# EAGLE design LB_BIT_i21_MICROPHONE-v03(rev4_4) (EAGLE 6.6.0)
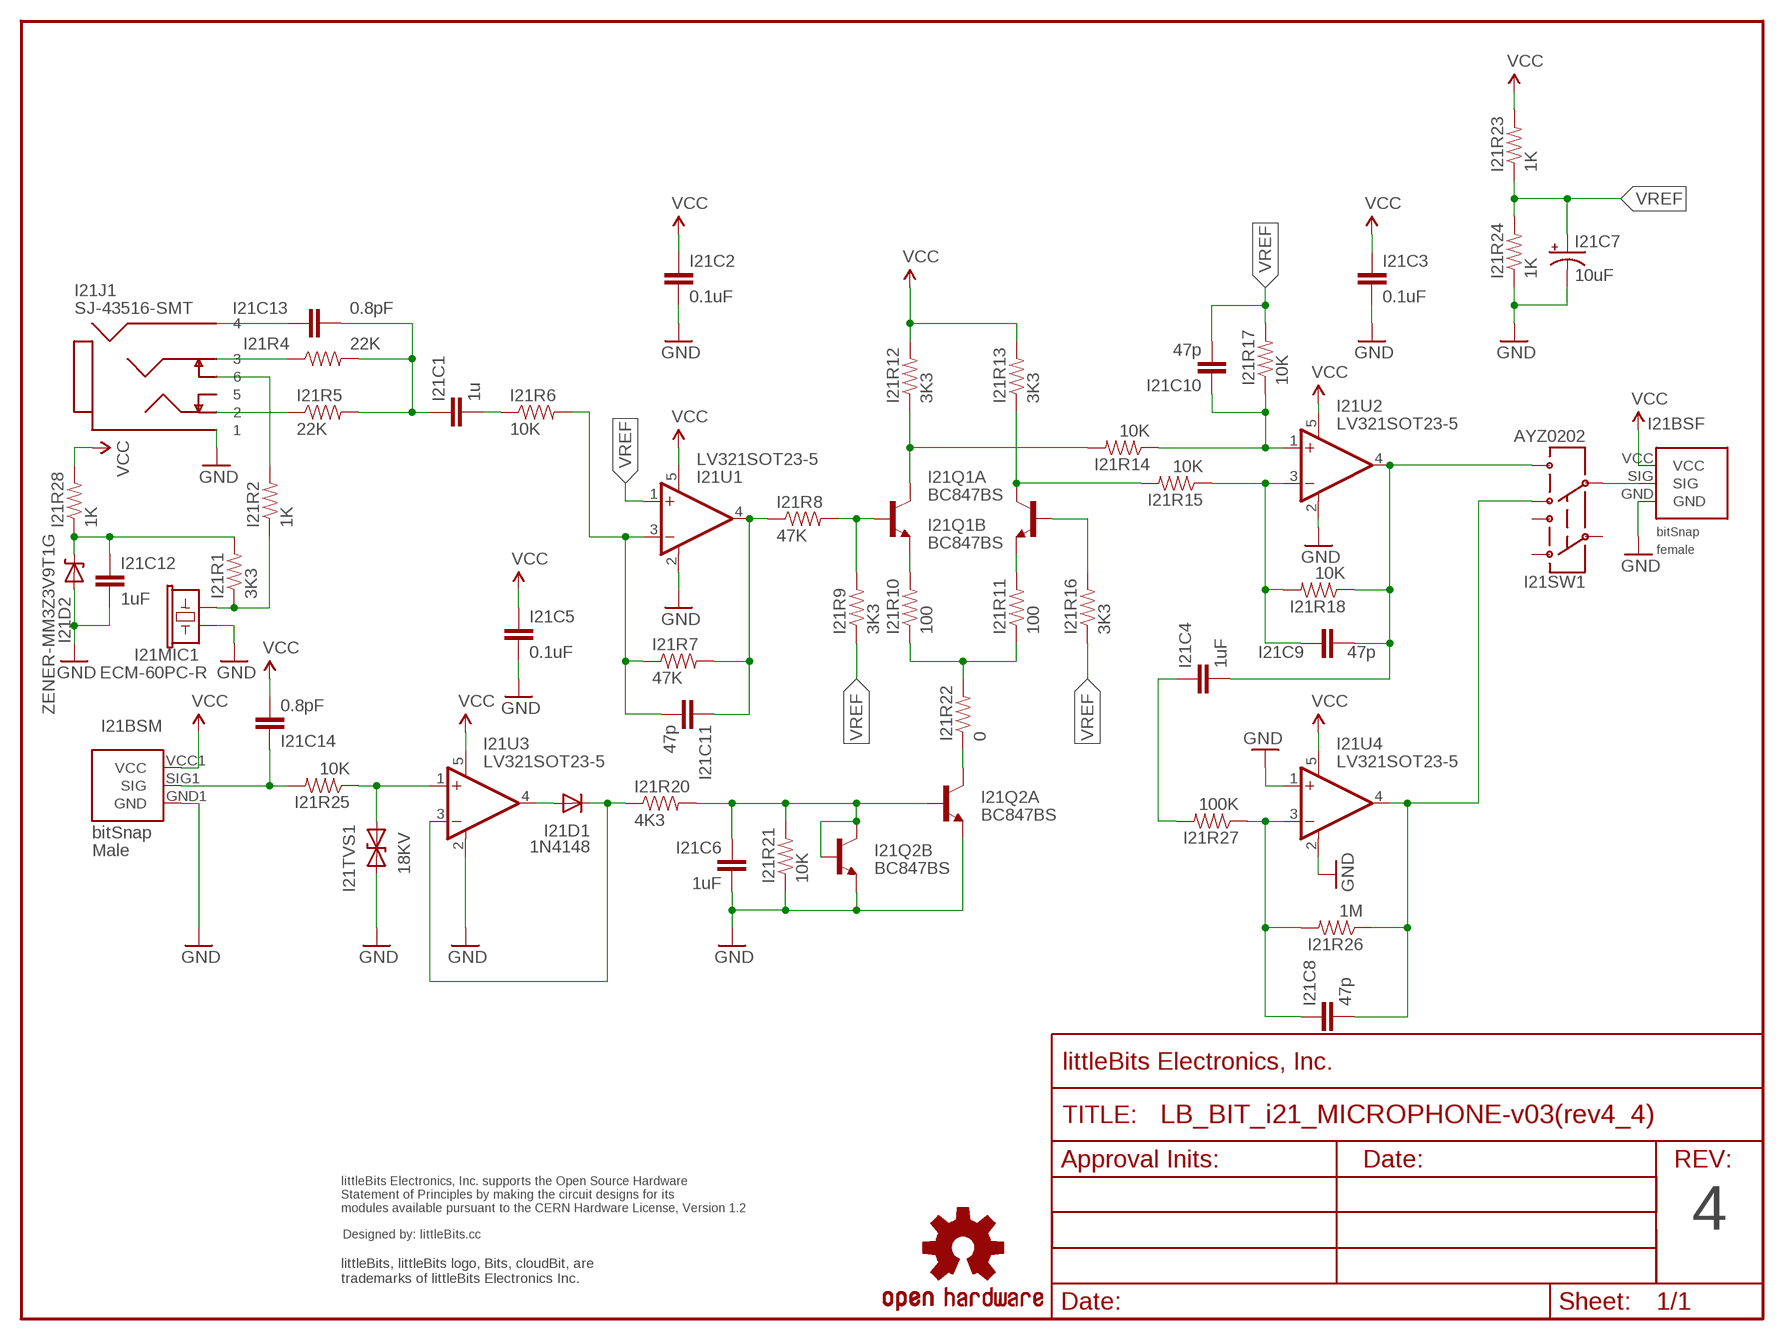
[diagram p0: schematic, sheet 1]

## Parts
I21BSF  BITSNAP_V03_FEMALE  [BITSNAP_V03_FEMALE]
I21BSM  BITSNAP_V03_MALE  [BITSNAP_V03_MALE]
I21C1  1u  CAPCAP-0603  [CAP-0603]
I21C2  0.1uF  CAPCAP-0603  [CAP-0603]
I21C3  0.1uF  CAPCAP-0603  [CAP-0603]
I21C4  1uF  CAPCAP-0603  [CAP-0603]
I21C5  0.1uF  CAPCAP-0603  [CAP-0603]
I21C6  1uF  CAPCAP-0603  [CAP-0603]
I21C7  10uF  CAP_POL3216  [EIA3216]
I21C8  47p  CAPCAP-0603  [CAP-0603]
I21C9  47p  CAPCAP-0603  [CAP-0603]
I21C10  47p  CAPCAP-0603  [CAP-0603]
I21C11  47p  CAPCAP-0603  [CAP-0603]
I21C12  1uF  CAPCAP-0603  [CAP-0603]
I21C13  0.8pF  CAPCAP-0603  [CAP-0603]
I21C14  0.8pF  CAPCAP-0603  [CAP-0603]
I21D1  1N4148  DIODESOD  [SOD-323]
I21D2  ZENER-MM3Z3V9T1G  DIODE-ZENER-BZT52  [SOD-323]
I21J1  SJ-43516-SMT  JACK-PHONO-4COND-SW  [CUI-SJ-4351]
I21MIC1  ECM-60PC-R  MIC9.7MM  [MIC9.7MM]
I21Q1  BC847BS  TRANS-BJT_NPN-DUAL-BC847BS  [SOT-363_PHILLIPS]
I21Q2  BC847BS  TRANS-BJT_NPN-DUAL-BC847BS  [SOT-363_PHILLIPS]
I21R1  3K3  RESISTOR0603  [RES-0603]
I21R2  1K  RESISTOR0603  [RES-0603]
I21R4  22K  RESISTOR0603  [RES-0603]
I21R5  22K  RESISTOR0603  [RES-0603]
I21R6  10K  RESISTOR0603  [RES-0603]
I21R7  47K  RESISTOR0603  [RES-0603]
I21R8  47K  RESISTOR0603  [RES-0603]
I21R9  3K3  RESISTOR0603  [RES-0603]
I21R10  100  RESISTOR0603  [RES-0603]
I21R11  100  RESISTOR0603  [RES-0603]
I21R12  3K3  RESISTOR0603  [RES-0603]
I21R13  3K3  RESISTOR0603  [RES-0603]
I21R14  10K  RESISTOR0603  [RES-0603]
I21R15  10K  RESISTOR0603  [RES-0603]
I21R16  3K3  RESISTOR0603  [RES-0603]
I21R17  10K  RESISTOR0603  [RES-0603]
I21R18  10K  RESISTOR0603  [RES-0603]
I21R20  4K3  RESISTOR0603  [RES-0603]
I21R21  10K  RESISTOR0603  [RES-0603]
I21R22  0  RESISTOR0603  [RES-0603]
I21R23  1K  RESISTOR0603  [RES-0603]
I21R24  1K  RESISTOR0603  [RES-0603]
I21R25  10K  RESISTOR0603  [RES-0603]
I21R26  1M  RESISTOR0603  [RES-0603]
I21R27  100K  RESISTOR0603  [RES-0603]
I21R28  1K  RESISTOR0603  [RES-0603]
I21SW1  AYZ0202  [AYZ0202]
I21TVS1  18KV  DIODE-TVSSOD-923  [SOD-923]
I21U1  LV321SOT23-5  [SOT23-5]
I21U2  LV321SOT23-5  [SOT23-5]
I21U3  LV321SOT23-5  [SOT23-5]
I21U4  LV321SOT23-5  [SOT23-5]
U$3  OSHWCREDIT  [OSHWCREDIT]
U$4  FRAME-LETTER-OHWOHW  [FABDWG01-OHW]
U$19  OSHW-LOGOL  [OSHW-LOGO-L]

## Nets
GND: I21BSF.GND I21BSM.GND1(GND) I21C2.2 I21C3.2 I21C5.2 I21C6.2 I21C7.- I21C12.2 I21D2.2(A) I21J1.1 I21MIC1.2 I21Q2.1(A:E) I21Q2.4(B:E) I21R21.1 I21R24.1 I21TVS1.1(A) I21U1.2(V-) I21U2.2(V-) I21U3.2(V-) I21U4.1(+IN) I21U4.2(V-)
N$1: I21BSM.SIG1(SIG) I21C14.1 I21R25.2
N$2: I21D1.2(A) I21U3.4(OUT)
N$3: I21D1.1(C) I21R20.1 I21U3.3(-IN)
N$4: I21R25.1 I21TVS1.2(C) I21U3.1(+IN)
N$5: I21C6.1 I21Q2.2(A:B) I21Q2.3(B:C) I21Q2.5(B:B) I21R20.2 I21R21.2
N$6: I21C13.1 I21J1.4
N$7: I21C1.1 I21C13.2 I21R4.2 I21R5.2
N$8: I21C1.2 I21R6.1
N$9: I21J1.6 I21R2.2
N$10: I21MIC1.1 I21R1.1 I21R2.1
N$11: I21C11.2 I21R6.2 I21R7.1 I21U1.3(-IN)
N$12: I21C11.1 I21R7.2 I21R8.1 I21U1.4(OUT)
N$13: I21Q1.2(A:B) I21R8.2 I21R9.2
N$14: I21Q1.1(A:E) I21R10.2
N$15: I21Q1.4(B:E) I21R11.2
N$16: I21R10.1 I21R11.1 I21R22.2
N$17: I21J1.2 I21R5.1
N$18: I21Q1.3(B:C) I21R13.1 I21R15.2
N$19: I21Q1.5(B:B) I21R16.2
N$20: I21Q1.6(A:C) I21R12.1 I21R14.2
N$21: I21C10.1 I21R14.1 I21R17.1 I21U2.1(+IN)
N$22: I21C9.1 I21R15.1 I21R18.2 I21U2.3(-IN)
N$23: I21C4.2 I21C9.2 I21R18.1 I21SW1.6 I21U2.4(OUT)
N$24: I21Q2.6(A:C) I21R22.1
N$25: I21BSF.SIG I21SW1.5
N$26: I21J1.3 I21R4.1
N$27: I21C8.1 I21R26.2 I21R27.1 I21U4.3(-IN)
N$28: I21C8.2 I21R26.1 I21SW1.4 I21U4.4(OUT)
N$29: I21C4.1 I21R27.2
N$30: I21C12.1 I21D2.1(C) I21R1.2 I21R28.1
VCC: I21BSF.VCC I21BSM.VCC1(VCC) I21C2.1 I21C3.1 I21C5.1 I21C14.2 I21R12.2 I21R13.2 I21R23.2 I21R28.2 I21U1.5(V+) I21U2.5(V+) I21U3.5(V+) I21U4.5(V+)
VREF: I21C7.+ I21C10.2 I21R9.1 I21R16.1 I21R17.2 I21R23.1 I21R24.2 I21U1.1(+IN)
Unconnected: I21J1.5 I21SW1.1 I21SW1.2 I21SW1.3

## Notes on the sheet
- 4

## Library data of the parts
I21BSF = bitSnap:BITSNAP_V03_FEMALE
I21BSM = bitSnap:BITSNAP_V03_MALE
I21C1-I21C6 I21C8-I21C14 = LITTLEBITS:CAP
I21C7 = LITTLEBITS:CAP_POL
I21D1 = LITTLEBITS:DIODE: Diode These are standard reverse protection diodes and small signal diodes. SMA package can handle up to about 1A. SOD-323 can handle about 200mA. What the SOD-323 package when ordering, there are some mfgs out there that are 5-pin packages.
I21D2 = LITTLEBITS:DIODE-ZENER: Zener Diode Production Part - 8199 3.4V Zener Voltage
I21J1 = LITTLEBITS:JACK-PHONO-4COND-SW
I21MIC1 = LITTLEBITS:MIC9.7MM
I21Q1 I21Q2 = LITTLEBITS:TRANS-BJT_NPN-DUAL
I21R1 I21R2 I21R4-I21R18 I21R20-I21R28 = LITTLEBITS:RESISTOR
I21SW1 = LITTLEBITS:AYZ0202
I21TVS1 = LITTLEBITS:DIODE-TVS: Bidirectional Transient Voltage Suppression Diode: Device conducts in avalanche mode after reaching a part dependent voltage threshold. Used for limiting voltage spikes on ESD sensitive inputs and outputs.; IEC_ESD_PROT0: +/-18kV; LB_PN: ?; MPN: ESD9B5.0ST5G; V_CLAMP: ?; V_OPERATION: 5V
I21U1-I21U4 = LITTLEBITS:LV321
U$3 = LITTLEBITS:OSHWCREDIT
U$4 = LITTLEBITS:FRAME-LETTER-OHW
U$19 = SparkFun_NEW:OSHW-LOGO: Open Source Hardware Logo This logo indicates the piece of hardware it is found on incorporates a OSHW license and/or adheres to the definition of open source hardware found here: http://freedomdefined.org/OSHW

## Board
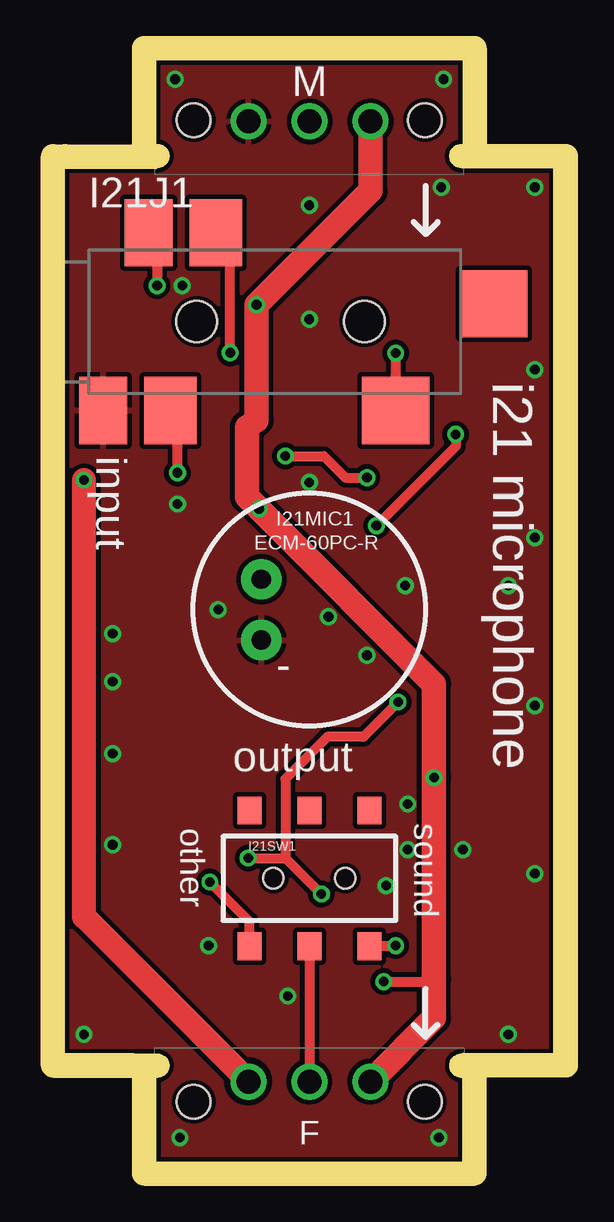
[diagram p1: board, top side]
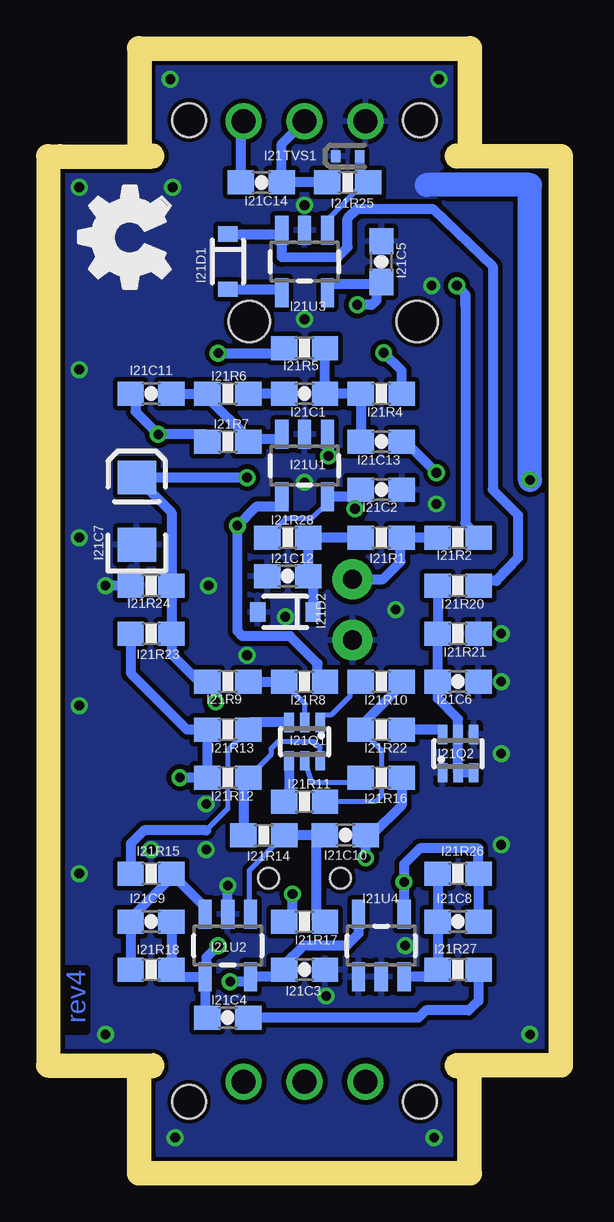
[diagram p2: board, bottom side, seen from below]

Size 20.4 x 45.9 mm. Coordinates in mm from the lower left corner, seen from the top.
Outline: 2.9,4.5 0,4.5 0,41.4
Outline: 20.4,4.5 20.4,41.4
Copper layers (1*16): Top 0.035mm / dielectric 1.5mm / Bottom 0.035mm
Design rules "littleBitsDRC": minimum track width 0.2mm, minimum drill 0.4mm, track to track 0.2mm, track to pad 0.2mm, pad to pad 0.2mm, via to via 0.2mm, smd to smd 0mil, copper to edge 0.2mm, drill to drill 0.2mm, minimum pad ring 0.2mm, minimum via ring 0.15mm, stop-mask expansion 0.1mm, vias tented up to drill 0mil, thermal gap 0.2mm
tRestrict: area 6.9,2.5 to 8.5,4.2; 2 lines
bRestrict: area 6.9,2.6 to 8.4,4.1; 2 lines
Milling: 6 lines

### Footprints (pad centres in the part's own frame; a part is rotated, then mirrored left to right if it is on the bottom)
BITSNAP_V03_FEMALE = drill 1: GND 3.91,3.33; SIG 6.45,3.33; VCC 8.99,3.33 | hole 1.4: 1.63,2.5; 11.27,2.5
BITSNAP_V03_MALE = drill 1: GND1 8.98,2.56; SIG1 6.44,2.56; VCC1 3.9,2.56 | hole 1.4: 11.27,2.5; 1.63,2.5
CAP-0603 = smd 1.1 x 1: 1 -0.85,0; 2 0.85,0
EIA3216 = smd 1.4 x 1.6: + 1.4,0; - -1.4,0
SOD-323 = smd 0.63 x 0.83: 1 -1.15,0; 2 1.15,0
CUI-SJ-4351 = smd 2 x 2.8: 1 0.6,-3.7; 6 2.5,3.7 | smd 2.8 x 2.8: 2 12.8,-3.7; 5 16.9,0.75 | smd 2.2 x 2.8: 3 5.3,3.7; 4 3.4,-3.7 | hole 1.7: 4.5,0; 11.5,0
MIC9.7MM = drill 0.8 pad 1.676: 1 -2,1.27; 2 -2,-1.27
SOT-363_PHILLIPS = smd 0.4 x 0.8: 1 -0.65,-0.8; 2 0,-0.8; 3 0.65,-0.8; 4 0.65,0.8; 5 0,0.8; 6 -0.65,0.8
RES-0603 = smd 1.1 x 1: 1 -0.85,0; 2 0.85,0
AYZ0202 = smd 1 x 1.15: 1 -2.5,2.825; 2 0,2.825; 3 2.5,2.825; 4 -2.5,-2.825; 5 0,-2.825; 6 2.5,-2.825 | hole 0.85: 1.5,0; -1.5,0
SOD-923 = smd 0.4 x 0.5: 1 -0.5,0; 2 0.5,0
SOT23-5 = smd 0.55 x 1.2: 1 -0.95,-1.3; 2 0,-1.3; 3 0.95,-1.3; 4 0.95,1.3; 5 -0.95,1.3

### Placement (x,y rotation side)
I21BSF  3.75,0 0 top
I21BSM  16.65,45.9 180 top
I21C1  10.2,32 180 bottom
I21C2  7,28 0 bottom
I21C3  10.2,8 0 bottom
I21C4  13.4,6 180 bottom
I21C5  7,37.5 90 bottom
I21C6  3.8,20 0 bottom
I21C7  17.2,27.1 90 bottom
I21C8  3.8,10 0 bottom
I21C9  16.6,10 0 bottom
I21C10  8.5,13.6 0 bottom
I21C11  16.6,32 0 bottom
I21C12  10.9,24.4 180 bottom
I21C13  7,30 180 bottom
I21C14  12,40.8 180 bottom
I21D1  13.4,37.5 270 bottom
I21D2  11,22.9 180 bottom
I21J1  1,35 0 top
I21MIC1  10.2,23 0 top
I21Q1  10.2,17.5 180 bottom
I21Q2  3.8,17 0 bottom
I21R1  7,26 180 bottom
I21R2  3.8,26 0 bottom
I21R4  7,32 180 bottom
I21R5  10.2,33.9 0 bottom
I21R6  13.4,32 180 bottom
I21R7  13.4,30 180 bottom
I21R8  10.2,20 180 bottom
I21R9  13.4,20 0 bottom
I21R10  7,20 180 bottom
I21R11  10.2,15 180 bottom
I21R12  13.4,16 180 bottom
I21R13  13.4,18 180 bottom
I21R14  11.9,13.6 180 bottom
I21R15  16.6,12 180 bottom
I21R16  7,16 180 bottom
I21R17  10.2,10 180 bottom
I21R18  16.6,8 180 bottom
I21R20  3.8,24 180 bottom
I21R21  3.8,22 180 bottom
I21R22  7,18 180 bottom
I21R23  16.6,22 180 bottom
I21R24  16.6,24 0 bottom
I21R25  8.4,40.8 180 bottom
I21R26  3.8,12 180 bottom
I21R27  3.8,8 0 bottom
I21R28  10.9,26 180 bottom
I21SW1  10.2,11.8 0 top
I21TVS1  8.4,41.9 0 bottom
I21U1  10.2,29 180 bottom
I21U2  13.4,9 180 bottom
I21U3  10.2,37.5 180 bottom
I21U4  7,9 0 bottom
U$3  -92.75,-63.6 0 top  (outside the outline)
U$4  0,0 0 top
U$8  [OSHW_FILLX150_NOTEXT]  15.81,35.56 0 top
U$19  -24.5,-71.59 0 top  (outside the outline)

### Tracks (layer width: path | path; a pad name or v marks a point on that pad's centre or on a via)
GND  (via drill 0.41)
  Top 1: I21BSF.GND 0.8,10.2 v0.8,28.4
  Bottom 0.2: I21U2.2
  Bottom 0.406: I21U2.2 v13.4,11.5 | I21R24.1 v18.5,24
  Bottom 1: v0.8,28.4 0.8,40.7 5.1,40.7
  other vias: 2,22 2,20 2,17 4.7,27.4 14.2,24 6.4,23 11,22.7 4.9,36.5 10.2,28.3 19.6,40.6 19.6,33 19.6,26 19.6,19 19.6,12 18.5,5.3 4.8,1 15.6,1 15.8,45.1 4.6,45.1 14.3,14.9 10.2,35.1 6,9 10.2,39.85 12.6,21.1 2,13.2 0.8,5.3 16.6,13 14.3,13 9.3,6.9 15.7,40.6
  pour Top: 0,0 0,45.9 20.4,45.9 20.4,0.05
  pour Bottom: 0,0 0,45.9 20.4,45.9 20.4,0.05
N$1
  Bottom 0.406: I21R25.2 I21C14.1 11.15,42.4 I21BSM.SIG1
N$2
  Bottom 0.406: I21D1.2 11.1,36.35 I21U3.4
N$3
  Bottom 0.406: I21D1.1 11.1,38.65 I21U3.3 11.15,37.69 8.8,37.7 8.4,38.1 8.4,39.3 8,39.7 4.85,39.7 2.35,37.3 2.35,28 1.3,26.95 1.3,25.15 2.2,24.2 2.75,24.2 I21R20.1
N$4
  Bottom 0.2: I21U3.1 9.25,39.25 7.7,40.8 I21R25.1
  Bottom 0.406: I21TVS1.2 7.9,41 7.75,41 I21R25.1
N$5
  Bottom 0.406: I21Q2.3 I21Q2.2 I21Q2.5 3.8,18.45 4.65,19.3 I21C6.1 I21R21.2 4.65,24.1 I21R20.2
N$6  (via drill 0.41)
  Top 0.406: v4.7,28.7 4.7,30.6 I21J1.4
  Bottom 0.406: I21C13.1 6,30 v4.7,28.7
N$7
  Bottom 0.406: I21R5.2 I21C1.1 I21R4.2 I21C13.2
N$8
  Bottom 0.406: I21C1.2 I21R6.1
N$9  (via drill 0.41)
  Top 0.406: I21J1.6 3.85,37.8 v3.85,36.5
  Bottom 0.406: v3.85,36.5 3.5,36.15 | 3.5,36.15 3.5,35.7 3.5,36.15 | 3.5,36.15 3.5,26.6 I21R2.2
N$10
  Bottom 0.406: I21MIC1.1 6.93,24.27 6.2,25 6.2,25.95 I21R1.1 I21R2.1
N$11
  Bottom 0.406: I21U1.3 11.15,30.15 11.2,30.1 12.35,30.1 I21R7.1 12.5,30.1 14.3,31.9 14.25,31.95 I21R6.2 I21C11.2
N$12  (via drill 0.41)
  Top 0.406: v16.3,30.3 16.3,29.8 v13,26.5
  Bottom 0.406: I21R8.1 9.65,20 9.65,20.75 10.8,21.9 12.8,21.9 13,22.1 v13,26.5 12.2,27.3 11.2,27.3 11.2,27.75 I21U1.4 | I21R7.2 14.3,30.3 v16.3,30.3 17.25,31.25 17.25,31.8 I21C11.1
N$13
  Bottom 0.2: 10.9,19.8 10.2,19.1 I21Q1.2
  Bottom 0.406: I21R9.2 I21R8.2 10.9,19.8
N$14
  Bottom 0.2: I21R10.2 8.3,19.55 8.3,19.4 9.1,18.6 9.6,18.6 9.6,18.35 I21Q1.1
N$15
  Bottom 0.406: I21Q1.4 10.85,15 I21R11.2
N$16
  Bottom 0.2: I21R11.1 7.25,15 7,15.25 7,17.15 I21R22.2 7.8,18 7.7,18.3 | I21R10.1 6.2,19.8
  Bottom 0.406: 6.2,19.8 7.7,18.3
N$17  (via drill 0.41)
  Top 0.406: I21J1.2 v13.8,33.69
  Bottom 0.406: v13.8,33.69 11.16,33.69 I21R5.1
N$18
  Bottom 0.2: I21R13.1 13.4,17.15 13.4,14.7 14.3,13.8
  Bottom 0.406: I21Q1.3 12.5,18.3 I21R13.1 | 14.3,13.8 16.9,13.8 17.45,13.25 I21R15.2
N$19
  Bottom 0.2: I21Q1.5 9.9,15.8 8.15,15.8
  Bottom 0.406: 8.15,15.8 8.05,15.8 I21R16.2
N$20
  Bottom 0.2: I21Q1.6 9.55,17.25 9.8,17.5 11.3,17.5 11.6,17.2 11.6,16.95 I21R12.1
  Bottom 0.406: I21R12.1 12.75,15.8 I21R14.2
N$21
  Bottom 0.2: 12.5,10.35 12.5,12.15 I21R14.1
  Bottom 0.406: I21R14.1 I21C10.1 9.7,13.6 9.7,10.05 9.4,10.05 I21R17.1 | I21U2.1 12.5,10.35
N$22
  Bottom 0.406: I21U2.3 14.35,10.6 I21R15.1 15.75,11.85 17.45,10.15 I21C9.1 I21R18.2
N$23  (via drill 0.41)
  Top 0.406: I21SW1.6 12.88,9 v13.8,9
  Bottom 0.406: I21C9.2 I21R18.1 15.75,7.7 I21U2.4 | I21U2.4 14.35,6 I21C4.2 | v13.8,9 14.3,8.5 14.3,8.05 I21U2.4
N$24
  Bottom 0.406: I21Q2.6 4.45,18 I21R22.1
N$25
  Top 0.406: I21SW1.5 I21BSF.SIG
N$26  (via drill 0.41)
  Top 0.406: v6.9,33.7 6.9,38.1 I21J1.3
  Bottom 0.406: I21R4.1 6.15,32.95 v6.9,33.7
N$27
  Bottom 0.406: I21R26.2 I21C8.1 I21R27.1 4.95,7.7 I21U4.3
N$28  (via drill 0.41)
  Top 0.406: I21SW1.4 7.7,10 v6.05,11.65
  Bottom 0.406: I21C8.2 I21R26.1 2.95,13.05 5.4,13.05 6.05,12.4 v6.05,11.65 I21U4.4
N$29
  Bottom 0.406: I21R27.2 2.95,6.7 3.35,6.3 5.15,6.3 5.45,6 I21C4.1
N$30
  Bottom 0.406: I21R1.2 I21R28.1 I21C12.1 9.85,24.4 I21D2.1
VCC  (via drill 0.41)
  Top 0.2: v8.1,27.2 8.3,26.9 8.3,27
  Top 0.406: v13.3,7.5 15.3,7.5 arc90 15.4,7.6
  Top 1.016: I21BSM.VCC1 12.75,40.45 v8,35.7 8,30.9 7.6,30.6 7.6,27.7 v8.1,27.2 8.3,27 15.4,19.9 v15.4,16 15.4,7.6 15.4,5.99 I21BSF.VCC
  Bottom 0.2: I21R28.2 10.95,26.8 9.9,26.8 9.3,27.4 9.25,27.65 | 8.15,27.7 8.1,27.7
  Bottom 0.406: I21C14.2 12.85,43.24 I21BSM.VCC1 | 9.25,27.8 I21U1.5 | v8,35.7 7.4,35.7 7.2,35.9 7.2,36.4 I21C5.1 7.1,36.55 9.25,36.55 I21U3.5 | v15.4,16 I21R12.2 I21R13.2 15.1,18 17.45,20.35 I21R23.2 | I21U4.5 7.95,9.5 8.45,9 10.25,9 11.05,8.2 I21C3.1 11.35,7.7 I21U2.5 12.45,7.65 12.6,7.5 v13.3,7.5 | 9.25,27.65 I21U1.5 | I21C2.1 8.15,27.7 I21U1.5 | 8.1,27.7 v8.1,27.2
VREF  (via drill 0.41)
  Top 0.406: v13.9,19.15 12.45,17.7 10.95,17.7 9.2,15.95 9.2,12.65 | 9.2,12.65 v10.7,11.15 | v9.2,29.4 10.8,29.4 11.7,28.5 v12.6,28.5 | v7.65,12.65 9.2,12.65
  Bottom 0.406: I21R17.2 10.95,10 10.7,10.1 v10.7,11.15 | 14.3,20.1 14.25,20.05 I21R9.1 | I21U1.1 9.2,30.05 v9.2,29.4 | v12.6,28.5 I21C7.+ 15.75,27.05 I21R24.2 I21R23.1 15.75,21.15 14.6,20 I21R9.1 | I21R16.1 6.15,14.85 7.4,13.6 I21C10.2 v7.65,12.65 | v13.9,19.15 13.9,19.75 I21R9.1

### Text on the board
Bottom: rev4
tPlace: i21 microphone | input | output | other | sound
tNames: ECM-60PC-R | I21MIC1
Milling: 1mm DIA. ROUTER PATH
Reference: X-LARGE
dxf: 4 | Microphone and audio input bit
tDocu: i21 BSM1 (PINK) | i21 BSF1 (PINK)